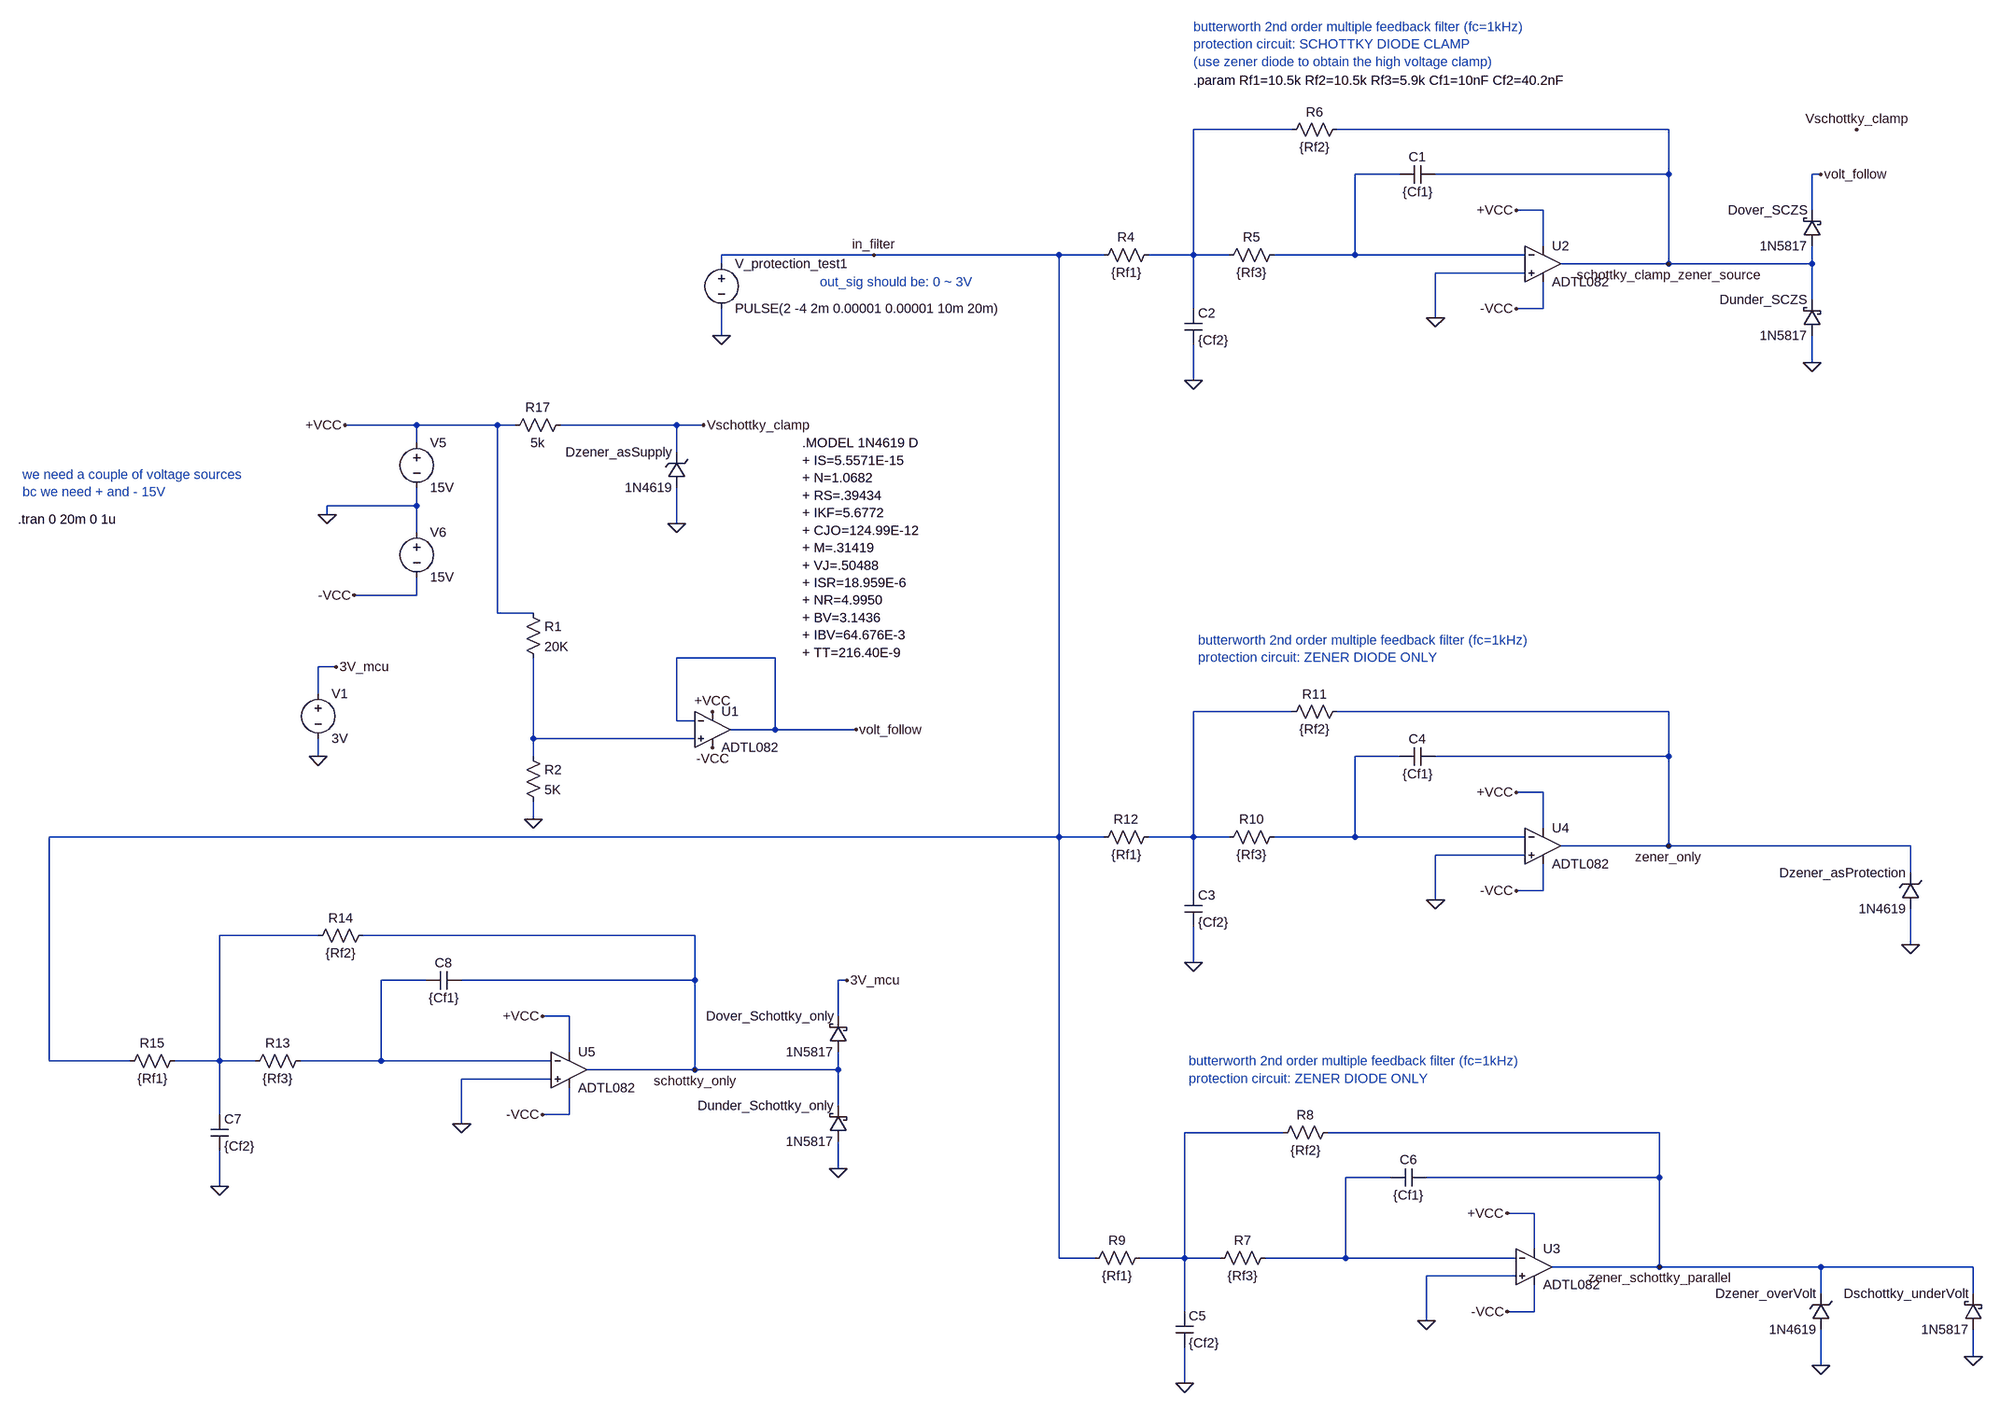
[diagram p0: schematic protection.asc]
protection.asc, the LTspice schematic file:
Version 4
SHEET 1 3368 2116
WIRE 1296 -144 1120 -144
WIRE 1968 -144 1376 -144
WIRE 1488 -64 1408 -64
WIRE 1968 -64 1968 -144
WIRE 1968 -64 1552 -64
WIRE 2240 -64 2224 -64
WIRE 1744 0 1696 0
WIRE 2224 0 2224 -64
WIRE 1744 64 1744 0
WIRE 528 80 256 80
WIRE 880 80 528 80
WIRE 960 80 880 80
WIRE 1120 80 1120 -144
WIRE 1120 80 1040 80
WIRE 1184 80 1120 80
WIRE 1408 80 1408 -64
WIRE 1408 80 1264 80
WIRE 1712 80 1408 80
WIRE 256 96 256 80
WIRE 1968 96 1968 -64
WIRE 1968 96 1776 96
WIRE 2224 96 2224 64
WIRE 2224 96 1968 96
WIRE 1712 112 1552 112
WIRE 2224 160 2224 96
WIRE 1120 176 1120 80
WIRE 1744 176 1744 128
WIRE 1744 176 1696 176
WIRE 1552 192 1552 112
WIRE 256 224 256 176
WIRE 2224 272 2224 224
WIRE 1120 304 1120 240
WIRE -288 384 -416 384
WIRE -144 384 -288 384
WIRE -112 384 -144 384
WIRE 176 384 -32 384
WIRE 224 384 176 384
WIRE -288 416 -288 384
WIRE 176 432 176 384
WIRE -288 528 -288 496
WIRE -288 528 -448 528
WIRE -448 544 -448 528
WIRE 176 560 176 496
WIRE -288 576 -288 528
WIRE -288 688 -288 656
WIRE -288 688 -400 688
WIRE -144 720 -144 384
WIRE -80 720 -144 720
WIRE 352 800 176 800
WIRE -432 816 -464 816
WIRE -464 864 -464 816
WIRE 1296 896 1120 896
WIRE 1968 896 1376 896
WIRE 176 912 176 800
WIRE 208 912 176 912
WIRE 352 928 352 800
WIRE 352 928 272 928
WIRE 496 928 352 928
WIRE -80 944 -80 800
WIRE 208 944 -80 944
WIRE -464 976 -464 944
WIRE -80 976 -80 944
WIRE 1488 976 1408 976
WIRE 1968 976 1968 896
WIRE 1968 976 1552 976
WIRE 1744 1040 1696 1040
WIRE -80 1088 -80 1056
WIRE 1744 1104 1744 1040
WIRE 880 1120 880 80
WIRE 880 1120 -944 1120
WIRE 960 1120 880 1120
WIRE 1120 1120 1120 896
WIRE 1120 1120 1040 1120
WIRE 1184 1120 1120 1120
WIRE 1408 1120 1408 976
WIRE 1408 1120 1264 1120
WIRE 1712 1120 1408 1120
WIRE 1968 1136 1968 976
WIRE 1968 1136 1776 1136
WIRE 2400 1136 1968 1136
WIRE 1712 1152 1552 1152
WIRE 2400 1184 2400 1136
WIRE 1120 1216 1120 1120
WIRE 1744 1216 1744 1168
WIRE 1744 1216 1696 1216
WIRE 1552 1232 1552 1152
WIRE -464 1296 -640 1296
WIRE 208 1296 -384 1296
WIRE 2400 1312 2400 1248
WIRE 1120 1344 1120 1280
WIRE -272 1376 -352 1376
WIRE 208 1376 208 1296
WIRE 208 1376 -208 1376
WIRE 480 1376 464 1376
WIRE -16 1440 -64 1440
WIRE 464 1440 464 1376
WIRE -16 1504 -16 1440
WIRE -944 1520 -944 1120
WIRE -800 1520 -944 1520
WIRE -640 1520 -640 1296
WIRE -640 1520 -720 1520
WIRE -576 1520 -640 1520
WIRE -352 1520 -352 1376
WIRE -352 1520 -496 1520
WIRE -48 1520 -352 1520
WIRE 208 1536 208 1376
WIRE 208 1536 16 1536
WIRE 464 1536 464 1504
WIRE 464 1536 208 1536
WIRE -48 1552 -208 1552
WIRE 464 1600 464 1536
WIRE -640 1616 -640 1520
WIRE -16 1616 -16 1568
WIRE -16 1616 -64 1616
WIRE -208 1632 -208 1552
WIRE 1280 1648 1104 1648
WIRE 1952 1648 1360 1648
WIRE 464 1712 464 1664
WIRE 1472 1728 1392 1728
WIRE 1952 1728 1952 1648
WIRE 1952 1728 1536 1728
WIRE -640 1744 -640 1680
WIRE 1728 1792 1680 1792
WIRE 1728 1856 1728 1792
WIRE 880 1872 880 1120
WIRE 944 1872 880 1872
WIRE 1104 1872 1104 1648
WIRE 1104 1872 1024 1872
WIRE 1168 1872 1104 1872
WIRE 1392 1872 1392 1728
WIRE 1392 1872 1248 1872
WIRE 1696 1872 1392 1872
WIRE 1952 1888 1952 1728
WIRE 1952 1888 1760 1888
WIRE 2240 1888 1952 1888
WIRE 2512 1888 2240 1888
WIRE 1696 1904 1536 1904
WIRE 2240 1936 2240 1888
WIRE 2512 1936 2512 1888
WIRE 1104 1968 1104 1872
WIRE 1728 1968 1728 1920
WIRE 1728 1968 1680 1968
WIRE 1536 1984 1536 1904
WIRE 2512 2048 2512 2000
WIRE 2240 2064 2240 2000
WIRE 1104 2096 1104 2032
FLAG 528 80 in_filter
FLAG 1696 176 -VCC
FLAG 1696 0 +VCC
FLAG -448 544 0
FLAG -416 384 +VCC
FLAG -400 688 -VCC
FLAG 1120 304 0
FLAG 1968 96 schottky_clamp_zener_source
FLAG 1552 192 0
FLAG 1696 1216 -VCC
FLAG 1696 1040 +VCC
FLAG 1120 1344 0
FLAG 1968 1136 zener_only
FLAG 1552 1232 0
FLAG 2304 -144 Vschottky_clamp
FLAG 2224 272 0
FLAG 176 560 0
FLAG 2400 1312 0
FLAG 224 384 Vschottky_clamp
FLAG 1680 1968 -VCC
FLAG 1680 1792 +VCC
FLAG 1104 2096 0
FLAG 1952 1888 zener_schottky_parallel
FLAG 1536 1984 0
FLAG 2240 2064 0
FLAG 2512 2048 0
FLAG -64 1616 -VCC
FLAG -64 1440 +VCC
FLAG -640 1744 0
FLAG 208 1536 schottky_only
FLAG -208 1632 0
FLAG 480 1376 3V_mcu
FLAG 464 1712 0
FLAG -464 976 0
FLAG -432 816 3V_mcu
FLAG 256 224 0
FLAG 240 896 +VCC
FLAG 240 960 -VCC
FLAG -80 1088 0
FLAG 496 928 volt_follow
FLAG 2240 -64 volt_follow
SYMBOL OpAmps\\ADTL082 1744 32 R0
SYMATTR InstName U2
SYMBOL voltage -288 400 R0
WINDOW 123 0 0 Left 0
WINDOW 39 0 0 Left 0
SYMATTR InstName V5
SYMATTR Value 15V
SYMBOL voltage -288 560 R0
WINDOW 123 0 0 Left 0
WINDOW 39 0 0 Left 0
SYMATTR InstName V6
SYMATTR Value 15V
SYMBOL res 1280 64 R90
WINDOW 0 0 56 VBottom 2
WINDOW 3 32 56 VTop 2
SYMATTR InstName R5
SYMATTR Value {Rf3}
SYMBOL cap 1104 176 R0
SYMATTR InstName C2
SYMATTR Value {Cf2}
SYMBOL cap 1552 -80 R90
WINDOW 0 0 32 VBottom 2
WINDOW 3 32 32 VTop 2
SYMATTR InstName C1
SYMATTR Value {Cf1}
SYMBOL res 1392 -160 R90
WINDOW 0 0 56 VBottom 2
WINDOW 3 32 56 VTop 2
SYMATTR InstName R6
SYMATTR Value {Rf2}
SYMBOL res 1056 64 R90
WINDOW 0 0 56 VBottom 2
WINDOW 3 32 56 VTop 2
SYMATTR InstName R4
SYMATTR Value {Rf1}
SYMBOL OpAmps\\ADTL082 1744 1072 R0
SYMATTR InstName U4
SYMBOL res 1280 1104 R90
WINDOW 0 0 56 VBottom 2
WINDOW 3 32 56 VTop 2
SYMATTR InstName R10
SYMATTR Value {Rf3}
SYMBOL cap 1104 1216 R0
SYMATTR InstName C3
SYMATTR Value {Cf2}
SYMBOL cap 1552 960 R90
WINDOW 0 0 32 VBottom 2
WINDOW 3 32 32 VTop 2
SYMATTR InstName C4
SYMATTR Value {Cf1}
SYMBOL res 1392 880 R90
WINDOW 0 0 56 VBottom 2
WINDOW 3 32 56 VTop 2
SYMATTR InstName R11
SYMATTR Value {Rf2}
SYMBOL res 1056 1104 R90
WINDOW 0 0 56 VBottom 2
WINDOW 3 32 56 VTop 2
SYMATTR InstName R12
SYMATTR Value {Rf1}
SYMBOL schottky 2240 64 R180
WINDOW 0 24 64 Left 2
WINDOW 3 24 0 Left 2
SYMATTR InstName Dover_SCZS
SYMATTR Value 1N5817
SYMBOL schottky 2240 224 R180
WINDOW 0 24 64 Left 2
WINDOW 3 24 0 Left 2
SYMATTR InstName Dunder_SCZS
SYMATTR Value 1N5817
SYMBOL zener 192 496 R180
WINDOW 0 24 64 Left 2
WINDOW 3 24 0 Left 2
SYMATTR InstName Dzener_asSupply
SYMATTR Value 1N4619
SYMBOL zener 2416 1248 R180
WINDOW 0 24 64 Left 2
WINDOW 3 24 0 Left 2
SYMATTR InstName Dzener_asProtection
SYMATTR Value 1N4619
SYMBOL res -16 368 R90
WINDOW 0 0 56 VBottom 2
WINDOW 3 32 56 VTop 2
SYMATTR InstName R17
SYMATTR Value 5k
SYMBOL OpAmps\\ADTL082 1728 1824 R0
SYMATTR InstName U3
SYMBOL res 1264 1856 R90
WINDOW 0 0 56 VBottom 2
WINDOW 3 32 56 VTop 2
SYMATTR InstName R7
SYMATTR Value {Rf3}
SYMBOL cap 1088 1968 R0
SYMATTR InstName C5
SYMATTR Value {Cf2}
SYMBOL cap 1536 1712 R90
WINDOW 0 0 32 VBottom 2
WINDOW 3 32 32 VTop 2
SYMATTR InstName C6
SYMATTR Value {Cf1}
SYMBOL res 1376 1632 R90
WINDOW 0 0 56 VBottom 2
WINDOW 3 32 56 VTop 2
SYMATTR InstName R8
SYMATTR Value {Rf2}
SYMBOL res 1040 1856 R90
WINDOW 0 0 56 VBottom 2
WINDOW 3 32 56 VTop 2
SYMATTR InstName R9
SYMATTR Value {Rf1}
SYMBOL zener 2256 2000 R180
WINDOW 0 24 64 Left 2
WINDOW 3 24 0 Left 2
SYMATTR InstName Dzener_overVolt
SYMATTR Value 1N4619
SYMBOL schottky 2528 2000 R180
WINDOW 0 24 64 Left 2
WINDOW 3 24 0 Left 2
SYMATTR InstName Dschottky_underVolt
SYMATTR Value 1N5817
SYMBOL OpAmps\\ADTL082 -16 1472 R0
SYMATTR InstName U5
SYMBOL res -480 1504 R90
WINDOW 0 0 56 VBottom 2
WINDOW 3 32 56 VTop 2
SYMATTR InstName R13
SYMATTR Value {Rf3}
SYMBOL cap -656 1616 R0
SYMATTR InstName C7
SYMATTR Value {Cf2}
SYMBOL cap -208 1360 R90
WINDOW 0 0 32 VBottom 2
WINDOW 3 32 32 VTop 2
SYMATTR InstName C8
SYMATTR Value {Cf1}
SYMBOL res -368 1280 R90
WINDOW 0 0 56 VBottom 2
WINDOW 3 32 56 VTop 2
SYMATTR InstName R14
SYMATTR Value {Rf2}
SYMBOL res -704 1504 R90
WINDOW 0 0 56 VBottom 2
WINDOW 3 32 56 VTop 2
SYMATTR InstName R15
SYMATTR Value {Rf1}
SYMBOL schottky 480 1504 R180
WINDOW 0 24 64 Left 2
WINDOW 3 24 0 Left 2
SYMATTR InstName Dover_Schottky_only
SYMATTR Value 1N5817
SYMBOL schottky 480 1664 R180
WINDOW 0 24 64 Left 2
WINDOW 3 24 0 Left 2
SYMATTR InstName Dunder_Schottky_only
SYMATTR Value 1N5817
SYMBOL voltage -464 848 R0
WINDOW 123 0 0 Left 0
WINDOW 39 0 0 Left 0
SYMATTR InstName V1
SYMATTR Value 3V
SYMBOL voltage 256 80 R0
WINDOW 123 0 0 Left 0
WINDOW 39 0 0 Left 0
SYMATTR InstName V_protection_test1
SYMATTR Value PULSE(2 -4 2m 0.00001 0.00001 10m 20m)
SYMBOL OpAmps\\ADTL082 240 864 R0
SYMATTR InstName U1
SYMBOL res -96 704 R0
SYMATTR InstName R1
SYMATTR Value 20K
SYMBOL res -96 960 R0
SYMATTR InstName R2
SYMATTR Value 5K
TEXT -992 472 Left 2 ;we need a couple of voltage sources\nbc we need + and - 15V
TEXT 432 128 Left 2 ;out_sig should be: 0 ~ 3V
TEXT -1000 552 Left 2 !.tran 0 20m 0 1u
TEXT 1120 -232 Left 2 !.param Rf1=10.5k Rf2=10.5k Rf3=5.9k Cf1=10nF Cf2=40.2nF
TEXT 1120 -328 Left 2 ;butterworth 2nd order multiple feedback filter (fc=1kHz)\nprotection circuit: SCHOTTKY DIODE CLAMP\n(use zener diode to obtain the high voltage clamp)
TEXT 1128 768 Left 2 ;butterworth 2nd order multiple feedback filter (fc=1kHz)\nprotection circuit: ZENER DIODE ONLY
TEXT 400 416 Left 2 !.MODEL 1N4619 D\n+ IS=5.5571E-15\n+ N=1.0682\n+ RS=.39434\n+ IKF=5.6772\n+ CJO=124.99E-12\n+ M=.31419\n+ VJ=.50488\n+ ISR=18.959E-6\n+ NR=4.9950\n+ BV=3.1436\n+ IBV=64.676E-3\n+ TT=216.40E-9
TEXT 1112 1520 Left 2 ;butterworth 2nd order multiple feedback filter (fc=1kHz)\nprotection circuit: ZENER DIODE ONLY

The netlist it stands for:
* protection.asc
XU2 0 N002 +VCC -VCC schottky_clamp_zener_source ADTL082  ; pins In+ In- V+ V- OUT
V5 +VCC 0 15V
V6 0 -VCC 15V
R5 N002 N001 {Rf3}
C2 N001 0 {Cf2}
C1 schottky_clamp_zener_source N002 {Cf1}
R6 schottky_clamp_zener_source N001 {Rf2}
R4 N001 in_filter {Rf1}
XU4 0 N005 +VCC -VCC zener_only ADTL082  ; pins In+ In- V+ V- OUT
R10 N005 N003 {Rf3}
C3 N003 0 {Cf2}
C4 zener_only N005 {Cf1}
R11 zener_only N003 {Rf2}
R12 N003 in_filter {Rf1}
Dover_SCZS schottky_clamp_zener_source volt_follow 1N5817
Dunder_SCZS 0 schottky_clamp_zener_source 1N5817
Dzener_asSupply 0 Vschottky_clamp 1N4619
Dzener_asProtection 0 zener_only 1N4619
R17 Vschottky_clamp +VCC 5k
XU3 0 N009 +VCC -VCC zener_schottky_parallel ADTL082  ; pins In+ In- V+ V- OUT
R7 N009 N008 {Rf3}
C5 N008 0 {Cf2}
C6 zener_schottky_parallel N009 {Cf1}
R8 zener_schottky_parallel N008 {Rf2}
R9 N008 in_filter {Rf1}
Dzener_overVolt 0 zener_schottky_parallel 1N4619
Dschottky_underVolt 0 zener_schottky_parallel 1N5817
XU5 0 N007 +VCC -VCC schottky_only ADTL082  ; pins In+ In- V+ V- OUT
R13 N007 N006 {Rf3}
C7 N006 0 {Cf2}
C8 schottky_only N007 {Cf1}
R14 schottky_only N006 {Rf2}
R15 N006 in_filter {Rf1}
Dover_Schottky_only schottky_only 3V_mcu 1N5817
Dunder_Schottky_only 0 schottky_only 1N5817
V1 3V_mcu 0 3V
V_protection_test1 in_filter 0 PULSE(2 -4 2m 0.00001 0.00001 10m 20m)
XU1 N004 volt_follow +VCC -VCC volt_follow ADTL082  ; pins In+ In- V+ V- OUT
R1 +VCC N004 20K
R2 N004 0 5K
.model D D
.lib standard.dio
* we need a couple of voltage sources
* bc we need + and - 15V
* out_sig should be: 0 ~ 3V
.tran 0 20m 0 1u
.param Rf1=10.5k Rf2=10.5k Rf3=5.9k Cf1=10nF Cf2=40.2nF
* butterworth 2nd order multiple feedback filter (fc=1kHz)
* protection circuit: SCHOTTKY DIODE CLAMP
* (use zener diode to obtain the high voltage clamp)
* butterworth 2nd order multiple feedback filter (fc=1kHz)
* protection circuit: ZENER DIODE ONLY
.MODEL 1N4619 D
+ IS=5.5571E-15
+ N=1.0682
+ RS=.39434
+ IKF=5.6772
+ CJO=124.99E-12
+ M=.31419
+ VJ=.50488
+ ISR=18.959E-6
+ NR=4.9950
+ BV=3.1436
+ IBV=64.676E-3
+ TT=216.40E-9
* butterworth 2nd order multiple feedback filter (fc=1kHz)
* protection circuit: ZENER DIODE ONLY
.lib ADI.lib
.backanno
.end